# Altium schematic sheet ExtensionConnector.SchDoc: Extension Connectors
size A4; Date: 9/24/2014; Author: P.A.; CompanyName: STMicroelectronics; Organization: Microcontrollers Division; Address1: 12, Rue Jules HOROWITZ; Address2: 38019 Grenoble; Address3: FRANCE; DocumentNumber: MB1189; Revision: B-07; SheetNumber: 3; SheetTotal: 12; Project: STM32F469I-DISCO
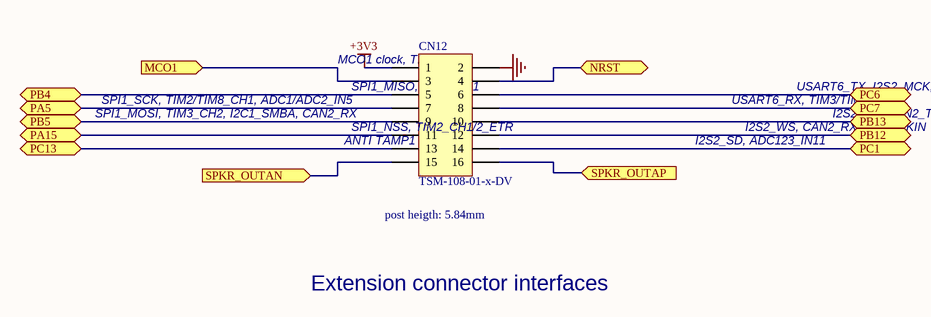
[diagram p0: ExtensionConnector.SchDoc]

## Parts
CN12  TSM-108-01-x-DV  [TSM-108-01-X-DV]

## Ports
MCO1 (in), NRST (bidir), PA5 (bidir), PA15 (bidir), PB4 (bidir), PB5 (bidir), PB12 (bidir), PB13 (bidir), PC1 (bidir), PC6 (bidir), PC7 (bidir), PC13 (bidir), SPKR_OUTAN (in), SPKR_OUTAP (in)

## Nets
+3V3: CN12.1
GND: CN12.2
MCO1: CN12.3 ; port MCO1
NRST: CN12.4 ; port NRST
PA5: CN12.7 ; port PA5
PA15: CN12.11 ; port PA15
PB4: CN12.5 ; port PB4
PB5: CN12.9 ; port PB5
PB12: CN12.12 ; port PB12
PB13: CN12.10 ; port PB13
PC1: CN12.14 ; port PC1
PC6: CN12.6 ; port PC6
PC7: CN12.8 ; port PC7
PC13: CN12.13 ; port PC13
SPKR_OUTAN: CN12.15 ; port SPKR_OUTAN
SPKR_OUTAP: CN12.16 ; port SPKR_OUTAP

## Notes on the sheet
- MCO1 clock, TIM1_CH1
- SPI1_MISO, TIM3_CH1
- USART6_TX, I2S2_MCK, TIM3/TIM8_CH1
- SPI1_MOSI, TIM3_CH2, I2C1_SMBA, CAN2_RX
- SPI1_SCK, TIM2/TIM8_CH1, ADC1/ADC2_IN5
- ANTI TAMP1
- SPI1_NSS, TIM2_CH1/2_ETR
- I2S2_SD, ADC123_IN11
- USART6_RX, TIM3/TIM8_CH2
- I2S2_WS, CAN2_RX, TIM1_BKIN
- I2S2_CK, CAN2_TX, USART3_CTS, TIM1_CH1N
- (near CN12) post heigth: 5.84mm
- Extension connector interfaces
- Title:
- Project:
- Size:
- Date:
- A4
- Reference:
- Sheet:
- Revision:
- of

## Library data of the parts
CN12 = Header 8X2: Header, 8-Pin, Dual row; Manuf_1: SAMTEC; Ordered by: Subcon; Silkscreen: EXT; LatestRevisionDate: 17-Jul-2002; LatestRevisionNote: Re-released for DXP Platform.; Publisher: Altium Limited; Manuf_Part_1: TSM-108-01-x-DV